# EasyEDA Pro project ProDoc_Schematic1_2026-01-19.epro

# Schematic Schematic1
Board Name: Board1; Create Date: 2025-10-25; Page Name: P1; Project Name: esp32s3n16r8; Schematic Name: Schematic1; Update Date: 2025-10-26; Company: 嘉立创EDA; Page Size: A4; Version: V1.0
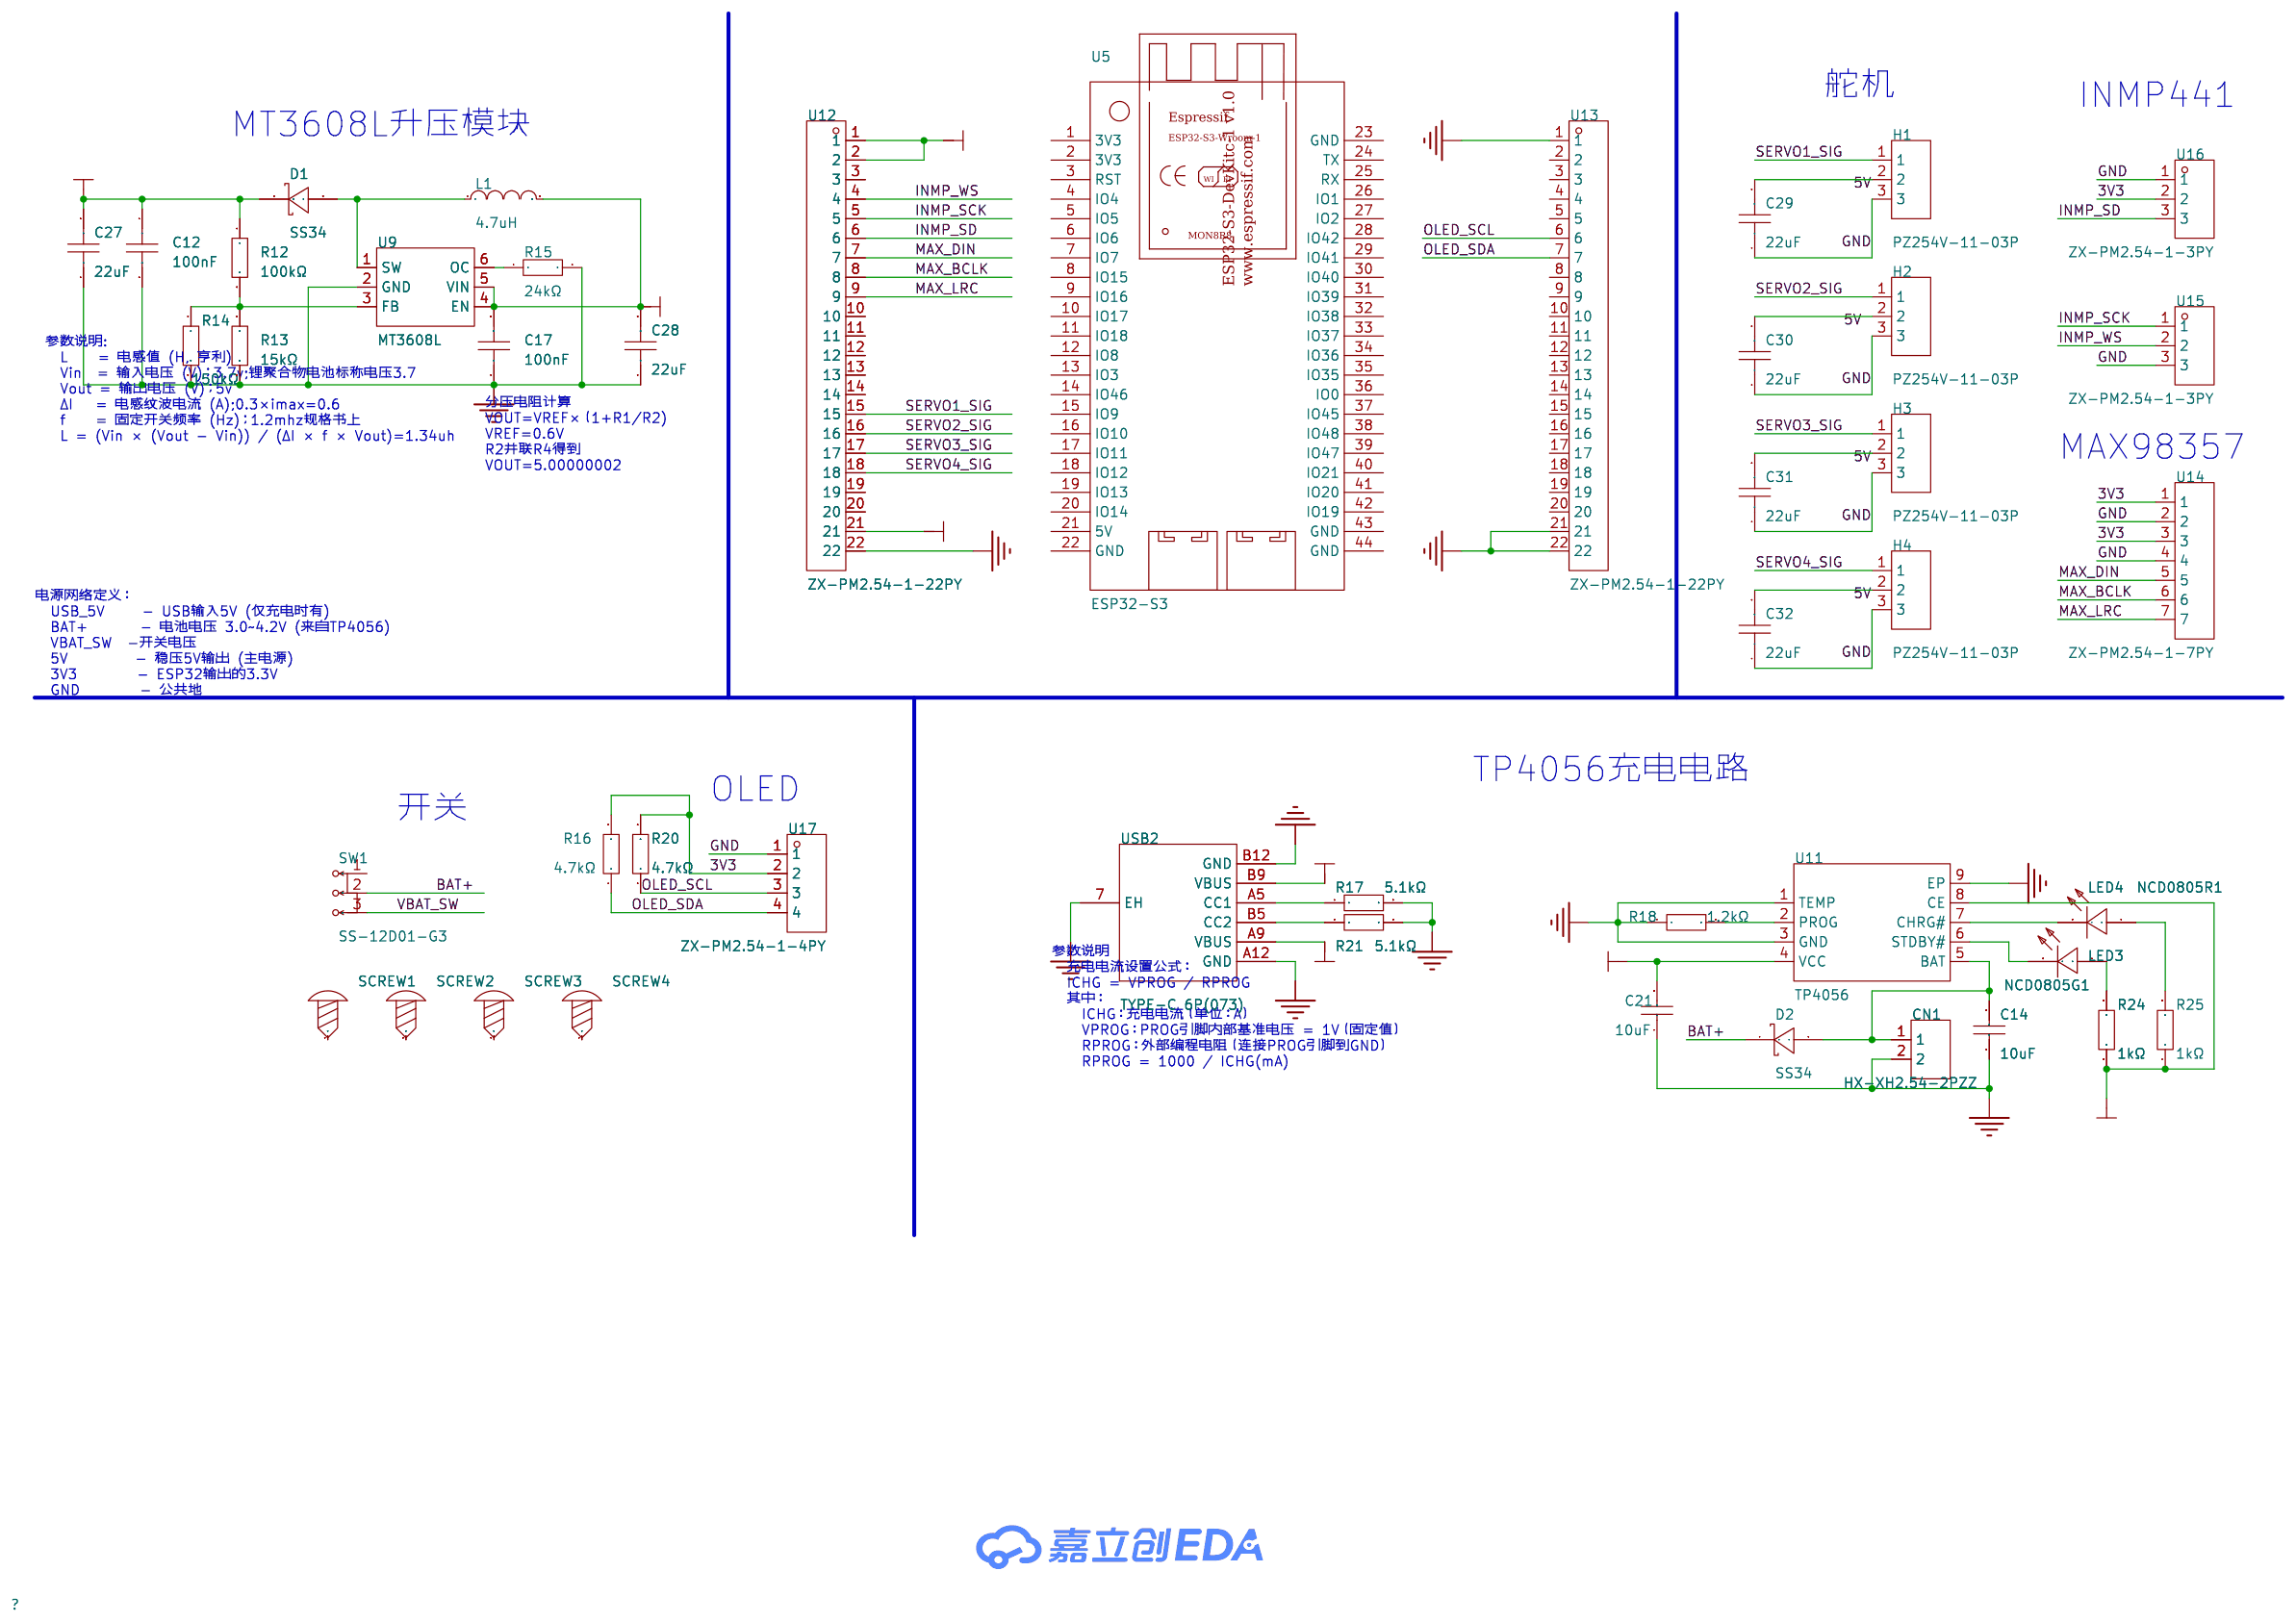
[diagram p0: schematic sheet]

## Parts
C12  100nF  [C0805]
C14  10uF  [C0805]
C17  100nF  [C0805]
C21  10uF  [C0805]
C27  22uF  [C0805]
C28  22uF  [C0805]
C29  22uF  [C0805]
C30  22uF  [C0805]
C31  22uF  [C0805]
C32  22uF  [C0805]
CN1  HX-XH2.54-2PZZ  [CONN-TH_2P-P2.50_HX-2.54MM-2P-ZZ-MS]
D1  SS34  [SMA_L4.3-W2.6-LS5.2-RD]
D2  SS34  [SMA_L4.3-W2.6-LS5.2-RD]
H1  PZ254V-11-03P  [HDR-TH_3P-P2.54-V-M]
H2  PZ254V-11-03P  [HDR-TH_3P-P2.54-V-M]
H3  PZ254V-11-03P  [HDR-TH_3P-P2.54-V-M]
H4  PZ254V-11-03P  [HDR-TH_3P-P2.54-V-M]
L1  4.7uH  [IND-SMD_L4.4-W4.2]
LED3  NCD0805G1  [LED0805-R-RD]
LED4  NCD0805R1  [LED0805-R-RD]
R12  100kΩ  [R0805]
R13  15kΩ  [R0805]
R14  150kΩ  [R0805]
R15  24kΩ  [R0805]
R16  4.7kΩ  [R0805]
R17  5.1kΩ  [R0805]
R18  1.2kΩ  [R0805]
R20  4.7kΩ  [R0805]
R21  5.1kΩ  [R0805]
R24  1kΩ  [R0805]
R25  1kΩ  [R0805]
SCREW1  -  [M3螺丝]
SCREW2  -  [M3螺丝]
SCREW3  -  [M3螺丝]
SCREW4  -  [M3螺丝]
SW1  SS-12D01-G3  [SW-TH_SS-12D01-GX]
U5  ESP32-S3  [ESP32-S3-DevKitC-1]
U9  MT3608L  [SOT-23-6_L2.9-W1.6-P0.95-LS2.8-BL_3]
U11  TP4056  [ESOP-8_L4.9-W3.9-P1.27-LS6.0-BL-EP]
U12  ZX-PM2.54-1-22PY  [HDR-TH_22P-P2.54-V-F]
U13  ZX-PM2.54-1-22PY  [HDR-TH_22P-P2.54-V-F]
U14  ZX-PM2.54-1-7PY  [HDR-TH_7P-P2.54-V-F]
U15  ZX-PM2.54-1-3PY  [HDR-TH_3P-P2.54-V-F]
U16  ZX-PM2.54-1-3PY  [HDR-TH_3P-P2.54-V-F]
U17  ZX-PM2.54-1-4PY  [HDR-TH_4P-P2.54-V-F]
USB2  TYPE-C 6P(073)  [TYPE-C-SMD_TYPE-C-6P-073]

## Library data of the parts
C12 C17 = CC0805KRX7R9BB104: 容值:100nF;精度:±10%;额定电压:50V;温度系数:X7R;; LCSC Part Name: 100nF ±10% 50V; Supplier Part: C49678; Manufacturer: YAGEO(国巨); Supplier Footprint: 0805; JLCPCB Part Class: Basic Part; Datasheet: https://item.szlcsc.com/datasheet/CC0805KRX7R9BB104/50686.html; Supplier: LCSC; Tolerance: ±10%; Voltage Rating: 50V; Temperature Coefficient: X7R
C14 C21 = CL21A106KPFNNNE: 容值:10uF;精度:±10%;额定电压:10V;温度系数:X5R;; LCSC Part Name: 10uF ±10% 10V; Supplier Part: C17024; Manufacturer: SAMSUNG(三星); Supplier Footprint: 0805; JLCPCB Part Class: 扩展库; Datasheet: https://item.szlcsc.com/datasheet/CL21A106KPFNNNE/17708.html; Supplier: LCSC; Tolerance: ±10%; Voltage Rating: 10V; Temperature Coefficient: X5R
C27-C32 = CL21A226MAQNNNE: 容值:22uF;精度:±20%;额定电压:25V;温度系数:X5R;; LCSC Part Name: 22uF ±20% 25V; Supplier Part: C45783; Manufacturer: SAMSUNG(三星); Supplier Footprint: 0805; JLCPCB Part Class: 基础库; Datasheet: https://item.szlcsc.com/datasheet/CL21A226MAQNNNE/46786.html; Supplier: LCSC; Tolerance: ±20%; Voltage Rating: 25V; Temperature Coefficient: X5R
CN1 = HX-XH2.54-2PZZ: 插针结构:1x2P;间距:2.54mm;安装方式:直插;参考系列:XH;总PIN数:2P;排数:1;每排PIN数:2;行距:-;额定电流:3A;触头材质:黄铜;触头镀层:锡;工作温度:-25℃~+85℃;; LCSC Part Name: 1x2P 间距:2.5mm 直插 系列:XH; Supplier Part: C42391660; Manufacturer: hanxia(韩下); Supplier Footprint: 插件,P=2.5mm; JLCPCB Part Class: 扩展库; Datasheet: https://item.szlcsc.com/datasheet/HX-XH2.54-2PZZ/44326932.html; Supplier: LCSC; Pins Structure: 1x2P; Pitch: 2.54mm; Mounting Type: 直插; Reference Series: XH; Number of Pins: 2P; Number of Rows: 1; Number of PINs Per Row: 2; Current Rating: 3A; Contact Material: 黄铜; Contact Plating: 锡; Operating Temperature: -25℃~+85℃; Voltage Rating: 250V; Plastic Material: PA66; Flame Retardant Rating: UL94V-0; Color: 白色
D1 D2 = SS34_C8678: 二极管配置:独立式;正向压降(Vf):550mV@3A;直流反向耐压(Vr):40V;整流电流:3A;; LCSC Part Name: 电压:40V 电流:3A; Supplier Part: C8678; Manufacturer: MDD(辰达半导体); Supplier Footprint: SMA(DO-214AC); JLCPCB Part Class: 基础库; Datasheet: https://item.szlcsc.com/datasheet/SS34/9178.html; Supplier: LCSC; Diode Configuration: 独立式; Voltage - Forward(Vf@If): 550mV@3A; Voltage - DC Reverse(Vr): 40V; Current - Rectified: 3A; Reverse Leakage Current (Ir): 500uA@40V; Operating Junction Temperature Range: -55℃~+125℃
H1-H4 = PZ254V-11-03P: 插针结构:1x3P;间距:2.54mm;行距:-;圆针/方针:方针;安装方式:直插;排数:单排;总PIN位数:3P;额定电流:3A;额定电压:250V;配合针长度:6mm;塑高:2.5mm;端接针长度:3mm;工作温度:-40℃~+105℃;颜色:黑色;; LCSC Part Name: 1x3P 间距:2.54mm 方针 直插; Supplier Part: C2937625; Manufacturer: XFCN(兴飞); Supplier Footprint: 插件,P=2.54mm; JLCPCB Part Class: 扩展库; Datasheet: https://item.szlcsc.com/datasheet/PZ254V-11-03P/3293280.html; Supplier: LCSC; Pin Structure: 1x3P; Pitch: 2.54mm; Circluar Pins/Square Pins: 方针; Mounting Type: 直插; Number of Rows: 单排; Number of Pins: 3P; Current Rating: 3A; Voltage Rating (Max): 250V; Length of Mating Pin: 6mm; Insulation Height: 2.5mm; Length of End Connection Pin: 3mm; Operating Temperature: -40℃~+105℃; Color: 黑色
L1 = FXL0420-4R7-M: 电感值:4.7uH;精度:±20%;额定电流:2.8A;饱和电流(Isat):3A;类型:一体成型电感;; LCSC Part Name: 4.7uH ±20% 3A; Supplier Part: C167208; Manufacturer: cjiang(长江微电); Supplier Footprint: SMD,4.2x4.4mm; JLCPCB Part Class: 扩展库; Datasheet: https://atta.szlcsc.com/upload/public/pdf/source/20240426/3189EA8206330E2108542F9E34E540E7.pdf; Supplier: LCSC; Tolerance: ±20%; Rated Current: 2.8A; Saturation Current (Isat): 3A; DC Resistance (DCR): 105mΩ; Type: 一体成型电感
LED3 = NCD0805G1: 灯头类型:-;发光颜色:绿色;正向压降(Vf):2.5V~3.6V;功率:72mW;正向电流:20mA;波长:525nm~537.5nm;二极管配置:-;透镜颜色:-;色温:-;发光强度:400mcd;发光角度:130°;载带方式:-;工作温度:-30℃~+85℃;; LCSC Part Name: 片式发光二极管; Supplier Part: C84260; Manufacturer: 国星光电; Supplier Footprint: 0805; JLCPCB Part Class: 扩展库; Datasheet: https://item.szlcsc.com/datasheet/NCD0805G1/85429.html; Supplier: LCSC; Illumination Color: 绿色; Voltage - Forward(Vf): 2.5V~3.6V; Power(Watts): 72mW; Forward Current: 20mA; Wavelength - Dominant: 525nm~537.5nm; Peak Wavelength: 520nm; Luminous Intensity: 400mcd; Viewing Angle: 130°; Operating Temperature: -30℃~+85℃
LED4 = NCD0805R1: 灯头类型:-;发光颜色:红色;正向电压(VF):1.6V~2.6V;功率:65mW;正向电流:20mA;主波长:615nm~630nm;二极管配置:独立二极管;透镜颜色:无色透明透镜;色温:-;发光强度:67mcd~195mcd;发光角度:130°;载带方式:-;工作温度:-30℃~+85℃;; Supplier Part: C84256; Manufacturer: 国星光电; Supplier Footprint: 0805; JLCPCB Part Class: 基础库; Datasheet: https://atta.szlcsc.com/upload/public/pdf/source/20200820/C84256_F0A75A43B3EAD75808600A0514C76B99.pdf; Supplier: LCSC; Emitted Color: 红色; Forward Voltage (VF): 1.6V~2.6V; Power Dissipation: 65mW; Forward Current: 20mA; Dominant Wavelength: 615nm~630nm; Diode Configuration: 独立二极管; Lens Color: 无色透明透镜; Luminous Intensity: 67mcd~195mcd; Viewing Angle: 130°; Operating Temperature: -30℃~+85℃
R12 = 0805W8F1003T5E: 电阻类型:厚膜电阻;阻值:100kΩ;精度:±1%;功率:125mW;工作电压:150V;温度系数:±100ppm/℃;; LCSC Part Name: 100kΩ ±1% 125mW 厚膜电阻; Supplier Part: C149504; Manufacturer: UNI-ROYAL(厚声); Supplier Footprint: 0805; JLCPCB Part Class: 基础库; Datasheet: https://item.szlcsc.com/datasheet/0805W8F1003T5E/160838.html; Supplier: LCSC; Type: 厚膜电阻; Tolerance: ±1%; Power(Watts): 125mW; Voltage-Supply(Max): 150V; Temperature Coefficient: ±100ppm/℃; Operating Temperature: -55℃~+155℃
R13 = 0805W8F1502T5E: 电阻类型:厚膜电阻;阻值:15kΩ;精度:±1%;功率:125mW;工作电压:150V;温度系数:±100ppm/℃;; LCSC Part Name: 15kΩ ±1% 125mW 厚膜电阻; Supplier Part: C17475; Manufacturer: UNI-ROYAL(厚声); Supplier Footprint: 0805; JLCPCB Part Class: 基础库; Datasheet: https://item.szlcsc.com/datasheet/0805W8F1502T5E/18163.html; Supplier: LCSC; Type: 厚膜电阻; Tolerance: ±1%; Power(Watts): 125mW; Voltage-Supply(Max): 150V; Temperature Coefficient: ±100ppm/℃; Operating Temperature: -55℃~+155℃
R14 = 0805W8F1503T5E: 电阻类型:厚膜电阻;阻值:150kΩ;精度:±1%;功率:125mW;最大工作电压:150V;温度系数:±100ppm/℃;; LCSC Part Name: 150kΩ ±1% 125mW 厚膜电阻; Supplier Part: C17470; Manufacturer: UNI-ROYAL(厚声); Supplier Footprint: 0805; Datasheet: https://atta.szlcsc.com/upload/public/pdf/source/20200306/C422600_1E6D84923E4A46A82E41ADD87F860B5C.pdf; Supplier: LCSC; Type: 厚膜电阻; Tolerance: ±1%; Power(Watts): 125mW; Overload Voltage (Max): 150V; Temperature Coefficient: ±100ppm/℃; Operating Temperature Range: -55℃~+155℃
R15 = 0805W8F2402T5E: 电阻类型:厚膜电阻;阻值:24kΩ;精度:±1%;功率:125mW;工作电压:150V;温度系数:±100ppm/℃;; LCSC Part Name: 24kΩ ±1% 125mW 厚膜电阻; Supplier Part: C17575; Manufacturer: UNI-ROYAL(厚声); Supplier Footprint: 0805; JLCPCB Part Class: 基础库; Datasheet: https://item.szlcsc.com/datasheet/0805W8F2402T5E/18263.html; Supplier: LCSC; Type: 厚膜电阻; Tolerance: ±1%; Power(Watts): 125mW; Voltage-Supply(Max): 150V; Temperature Coefficient: ±100ppm/℃; Operating Temperature: -55℃~+155℃
R16 R20 = 0805W8F4701T5E: 电阻类型:厚膜电阻;阻值:4.7kΩ;精度:±1%;功率:125mW;最大工作电压:150V;温度系数:±100ppm/℃;; LCSC Part Name: 4.7kΩ ±1% 125mW 厚膜电阻; Supplier Part: C17673; Manufacturer: UNI-ROYAL(厚声); Supplier Footprint: 0805; JLCPCB Part Class: 基础库; Datasheet: https://atta.szlcsc.com/upload/public/pdf/source/20200306/C422600_1E6D84923E4A46A82E41ADD87F860B5C.pdf; Supplier: LCSC; Type: 厚膜电阻; Tolerance: ±1%; Power(Watts): 125mW; Overload Voltage (Max): 150V; Temperature Coefficient: ±100ppm/℃; Operating Temperature Range: -55℃~+155℃
R17 R21 = 0805W8F5101T5E: 电阻类型:厚膜电阻;阻值:5.1kΩ;精度:±1%;功率:125mW;工作电压:150V;温度系数:±100ppm/℃;; LCSC Part Name: 5.1kΩ ±1% 125mW 厚膜电阻; Supplier Part: C27834; Manufacturer: UNI-ROYAL(厚声); Supplier Footprint: 0805; Datasheet: https://item.szlcsc.com/datasheet/0805W8F5101T5E/28584.html; Supplier: LCSC; Type: 厚膜电阻; Tolerance: ±1%; Power(Watts): 125mW; Voltage-Supply(Max): 150V; Temperature Coefficient: ±100ppm/℃; Operating Temperature: -55℃~+155℃
R18 = 0805W8F1201T5E: 电阻类型:厚膜电阻;阻值:1.2kΩ;精度:±1%;功率:125mW;工作电压:150V;温度系数:±100ppm/℃;; LCSC Part Name: 1.2kΩ ±1% 125mW 厚膜电阻; Supplier Part: C17379; Manufacturer: UNI-ROYAL(厚声); Supplier Footprint: 0805; JLCPCB Part Class: 基础库; Datasheet: https://item.szlcsc.com/datasheet/0805W8F1201T5E/18067.html; Supplier: LCSC; Type: 厚膜电阻; Tolerance: ±1%; Power(Watts): 125mW; Voltage-Supply(Max): 150V; Temperature Coefficient: ±100ppm/℃; Operating Temperature: -55℃~+155℃
R24 R25 = 0805W8F1001T5E: 电阻类型:厚膜电阻;阻值:1kΩ;精度:±1%;功率:125mW;最大工作电压:150V;温度系数:±100ppm/℃;; LCSC Part Name: 1kΩ ±1% 125mW 厚膜电阻; Supplier Part: C17513; Manufacturer: UNI-ROYAL(厚声); Supplier Footprint: 0805; JLCPCB Part Class: 基础库; Datasheet: https://atta.szlcsc.com/upload/public/pdf/source/20200306/C422600_1E6D84923E4A46A82E41ADD87F860B5C.pdf; Supplier: LCSC; Type: 厚膜电阻; Tolerance: ±1%; Power(Watts): 125mW; Overload Voltage (Max): 150V; Temperature Coefficient: ±100ppm/℃; Operating Temperature Range: -55℃~+155℃
SCREW1-SCREW4 = M3螺丝: Supplier Footprint: 插件; Check: false
SW1 = SS-12D01-G3: 电路结构:单刀双掷;额定电流:300mA;额定电压:50V;工作寿命:1万次;; LCSC Part Name: 8.8*3.9*4.0mm/柄长3MM,1P2T; Supplier Part: C698216; Manufacturer: USAKRO(美韩); Supplier Footprint: 插件; JLCPCB Part Class: 扩展库; Datasheet: https://item.szlcsc.com/datasheet/SS-12D01-G3/733031.html; Supplier: LCSC; Circuit: 单刀双掷; Current Rating: 300mA; Voltage Rating: 50V; Life: 1万次
U5 = ESP32-S3-DEVKITC-1: ESP32-S3-DEVKITC-1-乐鑫官方开发板; Manufacturer: 乐鑫科技; Supplier: 乐鑫科技; link: https://www.espressif.com/zh-hans/products/socs/esp32-s3; Check: false
U9 = MT3608L: 功能类型:升压型;工作电压:2.2V~16V;输出电压:-;输出电流:2.5A;输出类型:可调;; LCSC Part Name: 高效2.5A 1.2MHz升压转换器; Supplier Part: C2932326; Manufacturer: 西安航天民芯; Supplier Footprint: SOT-23-6; JLCPCB Part Class: 扩展库; Datasheet: https://item.szlcsc.com/datasheet/MT3608L/3276649.html; Supplier: LCSC; Function: 升压型; Voltage - Supply: 2.2V~16V; Output Current: 2.5A; Frequency - Switching: 1.2MHz; Operating Temperature: -40℃~+85℃@(TA); Synchronous Rectifier: 否; Number of Outputs: 1; Topology: 升压式; Quiescent Current: 100uA; Switch tube (built-in/external): 内置; Output Type: 可调
U11 = TP4056_C725790: 工作电压:3.7V~6.5V;最大充电电流:1A;电池类型:锂离子;电池节数:1;; LCSC Part Name: 1A独立式线性锂离子电池充电器; Supplier Part: C725790; Manufacturer: UMW(友台半导体); Supplier Footprint: ESOP-8; JLCPCB Part Class: 扩展库; Datasheet: https://item.szlcsc.com/datasheet/TP4056/772193.html; Supplier: LCSC; The Chip Type: 线性充电芯片; Voltage - Supply: 3.7V~6.5V; Charge Current - Max: 1A; Charging Saturation Voltage: 4.2V; Type of Battery: 锂离子; Number of Cells: 1; Operating Temperature: -40℃~+85℃; Battery Temperature Detection: 支持; 0V Battery Charge: 支持; Supply Current (Iq): 35uA
U12 U13 = ZX-PM2.54-1-22PY: 插孔结构:1x22P;间距:2.54mm;行距:-;圆孔/方孔:方孔;安装方式:直插;排数:单排;总孔位数:22P;额定电流:3A;额定电压:-;插孔方向:顶部;塑高:8.5mm;触头材质:-;触头镀层:金;工作温度:-40℃~+105℃;; LCSC Part Name: 1x22P 间距:2.54mm 直插; Supplier Part: C7499337; Manufacturer: Megastar(兆星); Supplier Footprint: 插件,P=2.54mm; JLCPCB Part Class: 扩展库; Datasheet: https://item.szlcsc.com/datasheet/ZX-PM2.54-1-22PY/8573998.html; Supplier: LCSC; Holes Structure: 1x22P; Pitch: 2.54mm; Circular Hole / Square Hole: 方孔; Mounting Type: 直插; Number of Rows: 单排; Number of Positions: 22P; Current Rating: 3A; Holes Direction: 顶部; Insulation Height: 8.5mm; Contact Plating: 金; Operating Temperature: -40℃~+105℃; PIN Length: 3.2mm
U14 = ZX-PM2.54-1-7PY: 插孔结构:1x7P;间距:2.54mm;行距:-;圆孔/方孔:方孔;安装方式:直插;排数:单排;总孔位数:7P;额定电流:3A;额定电压:-;插孔方向:顶部;塑高:8.5mm;触头材质:-;触头镀层:金;工作温度:-40℃~+105℃;; LCSC Part Name: 1x7P 间距:2.54mm 直插; Supplier Part: C7499327; Manufacturer: Megastar(兆星); Supplier Footprint: 插件,P=2.54mm; JLCPCB Part Class: 扩展库; Datasheet: https://item.szlcsc.com/datasheet/ZX-PM2.54-1-7PY/8573988.html; Supplier: LCSC; Holes Structure: 1x7P; Pitch: 2.54mm; Circular Hole / Square Hole: 方孔; Mounting Type: 直插; Number of Rows: 单排; Number of Positions: 7P; Current Rating: 3A; Holes Direction: 顶部; Insulation Height: 8.5mm; Contact Plating: 金; Operating Temperature: -40℃~+105℃; PIN Length: 3.2mm
U15 U16 = ZX-PM2.54-1-3PY: 插孔结构:1x3P;间距:2.54mm;行距:-;圆孔/方孔:方孔;安装方式:直插;排数:单排;总孔位数:3P;额定电流:3A;额定电压:-;插孔方向:顶部;塑高:8.5mm;触头材质:-;触头镀层:金;工作温度:-40℃~+105℃;; LCSC Part Name: 1x3P 间距:2.54mm 直插; Supplier Part: C7499323; Manufacturer: Megastar(兆星); Supplier Footprint: 插件,P=2.54mm; Datasheet: https://item.szlcsc.com/datasheet/ZX-PM2.54-1-3PY/8573984.html; Supplier: LCSC; Holes Structure: 1x3P; Pitch: 2.54mm; Circular Hole / Square Hole: 方孔; Mounting Type: 直插; Number of Rows: 单排; Number of Positions: 3P; Current Rating: 3A; Holes Direction: 顶部; Insulation Height: 8.5mm; Contact Plating: 金; Operating Temperature: -40℃~+105℃; PIN Length: 3.2mm
U17 = ZX-PM2.54-1-4PY: 插孔结构:1x4P;间距:2.54mm;行距:-;圆孔/方孔:方孔;安装方式:直插;排数:单排;总孔位数:4P;额定电流:3A;额定电压:-;插孔方向:顶部;塑高:8.5mm;触头材质:-;触头镀层:金;工作温度:-40℃~+105℃;; LCSC Part Name: 1x4P 间距:2.54mm 直插; Supplier Part: C7499324; Manufacturer: Megastar(兆星); Supplier Footprint: 插件,P=2.54mm; JLCPCB Part Class: 扩展库; Datasheet: https://item.szlcsc.com/datasheet/ZX-PM2.54-1-4PY/8573985.html; Supplier: LCSC; Holes Structure: 1x4P; Pitch: 2.54mm; Circular Hole / Square Hole: 方孔; Mounting Type: 直插; Number of Rows: 单排; Number of Positions: 4P; Current Rating: 3A; Holes Direction: 顶部; Insulation Height: 8.5mm; Contact Plating: 金; Operating Temperature: -40℃~+105℃; PIN Length: 3.2mm
USB2 = TYPE-C 6P(073): 连接器类型:Type-C;标准:USB 3.1;公母:母;安装方式:卧贴;触点数量:6P;端口数量:1;额定电流 - 电源:3A;工作温度范围:-25℃~+85℃;; LCSC Part Name: Type-C 母 卧贴; Supplier Part: C668623; Manufacturer: SHOU HAN(首韩); Supplier Footprint: SMD; JLCPCB Part Class: 扩展库; Datasheet: https://atta.szlcsc.com/upload/public/pdf/source/20200618/C668623_A4B260DED7AC1949BAC6AE39E9F4CD80.pdf; Supplier: LCSC; Connector Type: Type-C; Standard: USB 3.1; Gender: 母; Mounting Style: 卧贴; Number of Contacts: 6P; Number of Ports: 1; Current Rating - Power (Max): 3A; Operating Temperature Range: -25℃~+85℃; Rated Voltage (Max): 5V; Connect-Disconnect Life: 1万次; Core Colour: 黑色

## Nets
3V3: R16.2 R20.2 U12.1 U12.2 U14.1 U14.3 U16.2 U17.2
5V: C12.1 C27.2 C29.2 C30.2 C31.2 C32.2 D1.1(K) H1.2 H2.2 H3.2 H4.2 R12.1 U12.21
GND: C12.2 C14.1 C17.1 C21.1 C27.1 C28.1 C29.1 C30.1 C31.1 C32.1 CN1.2 H1.3 H2.3 H3.3 H4.3 R13.2 R14.2 R15.2 R17.2 R18.1 R21.2 U9.2(GND) U11.1(TEMP) U11.3(GND) U11.9(EP) U12.22 U13.1 U13.21 U13.22 U14.2 U14.4 U15.3 U16.1 U17.1 USB2.7(EH) USB2.A12(GND) USB2.B12(GND)
VBAT_SW: C17.2 C28.2 L1.2 SW1.3 U9.4(EN) U9.5(VIN)
BAT+: D2.1(K) SW1.2
INMP_SCK: U12.5 U15.1
INMP_SD: U12.6 U16.3
INMP_WS: U12.4 U15.2
MAX_BCLK: U12.8 U14.6
MAX_DIN: U12.7 U14.5
MAX_LRC: U12.9 U14.7
OLED_SCL: R20.1 U13.6 U17.3
OLED_SDA: R16.1 U13.7 U17.4
SERVO1_SIG: H1.1 U12.15
SERVO2_SIG: H2.1 U12.16
SERVO3_SIG: H3.1 U12.17
SERVO4_SIG: H4.1 U12.18
USB_5V: C21.2 R24.1 R25.1 U11.4(VCC) U11.8(CE) USB2.A9(VBUS) USB2.B9(VBUS)
Net-(C14-2): C14.2 CN1.1 D2.2(A) U11.5(BAT)
Net-(D1-2): D1.2(A) L1.1 U9.1(SW)
Net-(LED3-1): LED3.1(A) R24.2
Net-(LED3-2): LED3.2(K) U11.6(STDBY#)
Net-(LED4-1): LED4.1(+) R25.2
Net-(LED4-2): LED4.2(-) U11.7(CHRG#)
Net-(R12-2): R12.2 R13.1 R14.1 U9.3(FB)
Net-(R15-1): R15.1 U9.6(OC)
Net-(R17-1): R17.1 USB2.A5(CC1)
Net-(R18-2): R18.2 U11.2(PROG)
Net-(R21-1): R21.1 USB2.B5(CC2)

Not connected (* = marked no-connect by the designer): SCREW1 1; SCREW2 1; SCREW3 1; SCREW4 1; SW1 1; U5 1(3V3) 2(3V3) 3(RST) 4(IO4) 5(IO5) 6(IO6) 7(IO7) 8(IO15) 9(IO16) 10(IO17) 11(IO18) 12(IO8) 13(IO3) 14(IO46) 15(IO9) 16(IO10) 17(IO11) 18(IO12) 19(IO13) 20(IO14) 21(5V) 22(GND) 23(GND) 24(TX) 25(RX) 26(IO1) 27(IO2) 28(IO42) 29(IO41) 30(IO40) 31(IO39) 32(IO38) 33(IO37) 34(IO36) 35(IO35) 36(IO0) 37(IO45) 38(IO48) 39(IO47) 40(IO21) 41(IO20) 42(IO19) 43(GND) 44(GND); U12 3 10 11 12 13 14 19 20; U13 2 3 4 5 8 9 10 11 12 13 14 15 16 17 18 19 20

## Notes on the sheet
- 舵机
- INMP441
- MT3608L升压模块
- 参数说明:
    L    = 电感值 (H, 亨利)
    Vin  = 输入电压 (V)；3.7v;锂聚合物电池标称电压3.7
    Vout = 输出电压 (V)；5v
    ΔI   = 电感纹波电流 (A);0.3×imax=0.6
    f    = 固定开关频率 (Hz)；1.2mhz规格书上
    L = (Vin × (Vout - Vin)) / (ΔI × f × Vout)=1.34uh
- MAX98357
- 分压电阻计算
  VOUT=VREF×（1+R1/R2)
  VREF=0.6V
  R2并联R4得到
  VOUT=5.00000002
- 电源网络定义：
    USB_5V     - USB输入5V (仅充电时有)
    BAT+       - 电池电压 3.0~4.2V (来自TP4056)
    VBAT_SW  -开关电压
    5V         - 稳压5V输出 (主电源)
    3V3        - ESP32输出的3.3V
    GND        - 公共地
- TP4056充电电路
- OLED
- 开关
- 参数说明
    充电电流设置公式：
    ICHG = VPROG / RPROG
    其中：
      ICHG：充电电流（单位：A）
      VPROG：PROG引脚内部基准电压 = 1V（固定值）
      RPROG：外部编程电阻（连接PROG引脚到GND）
      RPROG = 1000 / ICHG(mA)
